# EAGLE design encoder_as5047p (EAGLE 9.3.1)
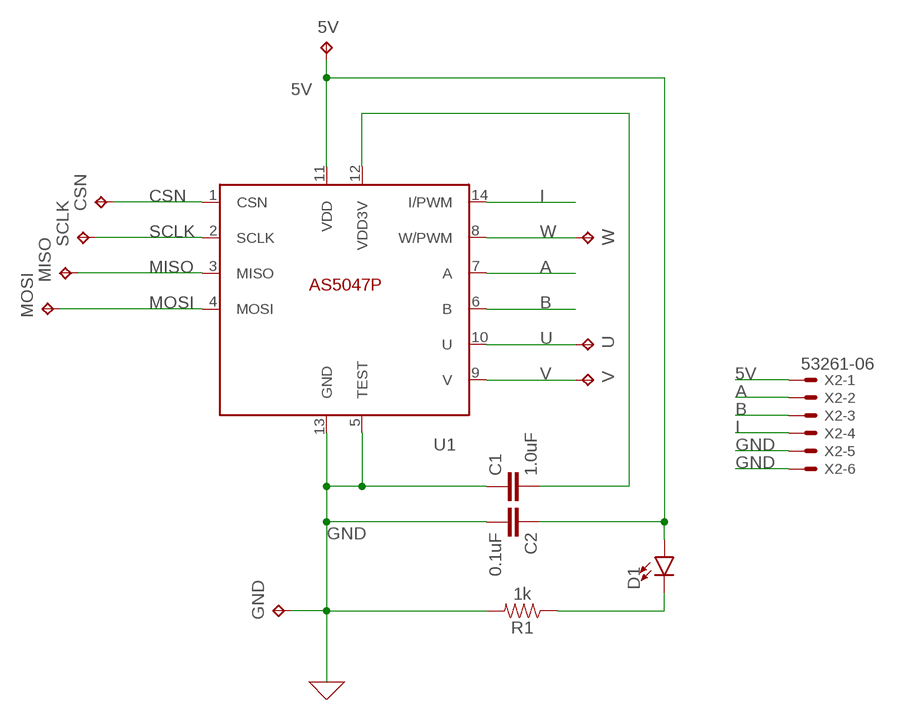
[diagram p0: schematic, sheet 1]

## Parts
5V  TPTP12R  [TP12R]
C1  1.0uF  1.0UF-0603-16V-10%  [0603]
C2  0.1uF  0.1UF-0603-25V-(+80/-20%)  [0603]
CSN  TPTP12R  [TP12R]
D1  LED0603  [LED-0603]
GND  TPTP12R  [TP12R]
MISO  TPTP12R  [TP12R]
MOSI  TPTP12R  [TP12R]
R1  1k  1KOHM-0603-1/10W-1%  [0603]
SCLK  TPTP12R  [TP12R]
U  TPTP12R  [TP12R]
U1  AS5047P  [TSSOP14]
V  TPTP12R  [TP12R]
W  TPTP12R  [TP12R]
X2  53261-06  [53261-06]

## Nets
5V: 5V.TP C2.1 D1.A U1.11(VDD) X2.1
A: U1.7(A) X2.2
B: U1.6(B) X2.3
CSN: CSN.TP U1.1(CSN)
GND: C1.1 C2.2 GND.TP R1.2 U1.5(TEST) U1.13(GND) X2.5 X2.6
I: U1.14(I/PWM) X2.4
MISO: MISO.TP U1.3(MISO)
MOSI: MOSI.TP U1.4(MOSI)
N$1: C1.2 U1.12(VDD3V)
N$2: D1.C R1.1
SCLK: SCLK.TP U1.2(SCLK)
U: U1.10(U) U.TP
V: U1.9(V) V.TP
W: U1.8(W/PWM) W.TP

## Library data of the parts
5V CSN GND MISO MOSI SCLK U V W = testpad:TP: Test pad
C1 = SparkFun-Capacitors:1.0UF: 1µF ceramic capacitors A capacitor is a passive two-terminal electrical component used to store electrical energy temporarily in an electric field.; PROD_ID: CAP-00868
C2 = SparkFun-Capacitors:0.1UF: 0.1µF ceramic capacitors A capacitor is a passive two-terminal electrical component used to store electrical energy temporarily in an electric field.; PROD_ID: CAP-00810
D1 = SparkFun-LED:LED: LED (Generic) Standard schematic elements and footprints for 5mm, 3mm, 1206, and 0603 sized LEDs. Generic LEDs with no color specified.
R1 = SparkFun-Resistors:1KOHM: 1kΩ resistor A resistor is a passive two-terminal electrical component that implements electrical resistance as a circuit element. Resistors act to reduce current flow, and, at the same time, act to lower voltage levels within circuits. - Wikipedia; PROD_ID: RES-07856
U1 = AMS-AS5047P-encoder:AS5047P
X2 = con-molex:53?-06: CONNECTOR wire to board 1.25 mm (.049 inch) pitch header; MF: MOLEX; OC_FARNELL: 1125375; OC_NEWARK: unknown

## Net classes
0 default: width 0.305 mm

## Board
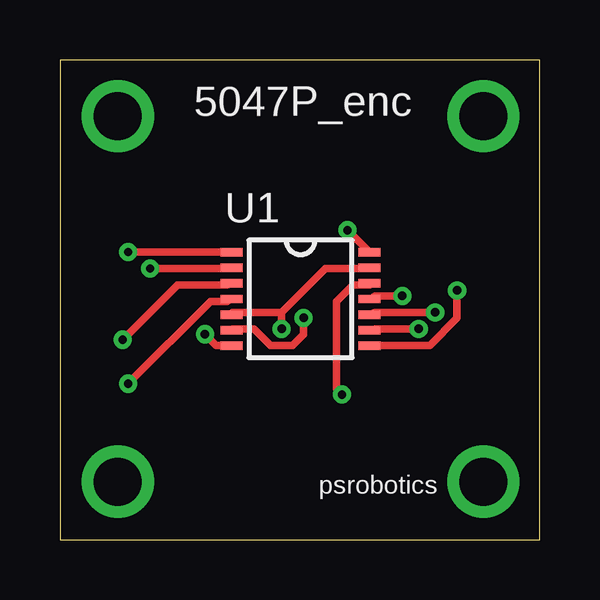
[diagram p1: board, top side]
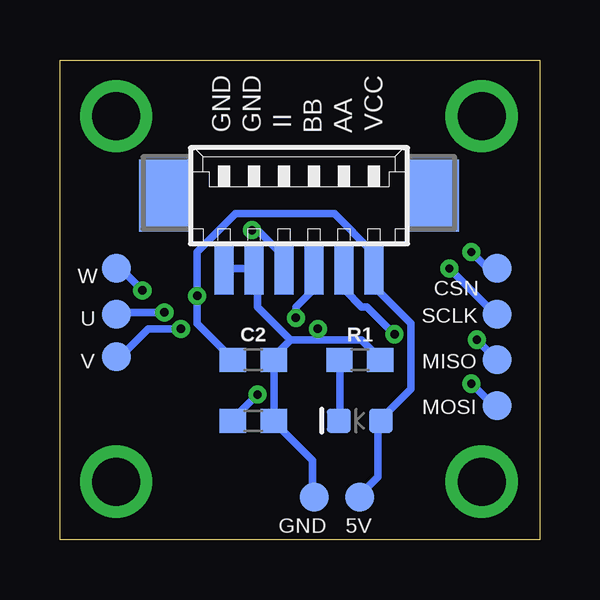
[diagram p2: board, bottom side, seen from below]

Size 20 x 20 mm. Coordinates in mm from the lower left corner, seen from the top.
Outline: 0,0 20,0 20,20 0,20 0,0
Copper layers (1*16): Top 0.035mm / dielectric 1.5mm / Bottom 0.035mm
Design rules "default": minimum track width 6mil, minimum drill 0.35mm, track to track 6mil, track to pad 6mil, pad to pad 6mil, via to via 6mil, smd to smd 6mil, copper to edge 40mil, drill to drill 6mil, minimum pad ring 10mil, minimum via ring 8mil, stop-mask expansion 4mil, vias tented up to drill 0mil, thermal gap 10mil

### Footprints (pad centres in the part's own frame; a part is rotated, then mirrored left to right if it is on the bottom)
TP12R = smd 1.2 x 1.2: TP 0,0
0603 = smd 1.1 x 1: 1 -0.85,0; 2 0.85,0
LED-0603 = smd 1 x 1: A -0.877,0; C 0.877,0
TSSOP14 = smd 0.9 x 0.35: 1 -2.875,1.95; 2 -2.875,1.3; 3 -2.875,0.65; 4 -2.875,0; 5 -2.875,-0.65; 6 -2.875,-1.3; 7 -2.875,-1.95; 8 2.875,-1.95; 9 2.875,-1.3; 10 2.875,-0.65; 11 2.875,0; 12 2.875,0.65; 13 2.875,1.3; 14 2.875,1.95
53261-06 = smd 0.8 x 2: 1 3.125,-2.5; 2 1.875,-2.5; 3 0.625,-2.5; 4 -0.625,-2.5; 5 -1.875,-2.5; 6 -3.125,-2.5 | smd 2.1 x 3: S1 5.625,0.625; S2 -5.625,0.625

### Placement (x,y rotation side)
5V  7.49,1.78 0 bottom
C1  11.94,4.95 180 bottom
C2  11.94,7.49 0 bottom
CSN  1.78,11.3 0 bottom
D1  7.49,4.95 180 bottom
GND  9.4,1.78 0 bottom
MISO  1.78,7.49 0 bottom
MOSI  1.78,5.59 0 bottom
R1  7.49,7.49 0 bottom
SCLK  1.78,9.4 0 bottom
U  17.65,9.4 0 bottom
U1  10.03,10.03 0 top
V  17.65,7.62 0 bottom
W  17.65,11.3 0 bottom
X2  10.03,13.72 0 bottom

### Tracks (layer width: path | path; a pad name or v marks a point on that pad's centre or on a via)
5V  (via drill 0.35)
  Top 0.305: v14.28,10.16 13.13,10.16 U1.11
  Bottom 0.305: C2.1 12.9,7.64 14.28,9.02 v14.28,10.16 14.28,11.99 12.68,13.59 8.56,13.59 6.96,11.99 6.96,11.3 X2.1 6.73,11.07 6.73,10.39 5.36,9.02 5.36,6.27 6.5,5.13 D1.A 6.73,4.9 6.73,2.62 7.42,1.93 5V.TP
A  (via drill 0.35)
  Top 0.305: v6.04,8.56 6.5,8.1 6.96,8.1 U1.7
  Bottom 0.305: v6.04,8.56 7.19,9.7 7.42,9.7 8.1,10.39 8.1,11.07 X2.2
B  (via drill 0.35)
  Top 0.305: v10.16,9.25 10.16,8.56 9.7,8.1 8.79,8.1 8.1,8.79 7.19,8.79 U1.6
  Bottom 0.305: v10.16,9.25 10.16,9.7 9.47,10.39 9.47,11.07 X2.3
CSN  (via drill 0.35)
  Top 0.305: v2.85,11.99 6.96,11.99 U1.1
  Bottom 0.305: v2.85,11.99 2.16,11.3 CSN.TP
GND  (via drill 0.35)
  Top 0.305: 9.25,9.47 7.19,9.47 U1.5 | 9.25,9.47 11.07,11.3 12.9,11.3 U1.13 | v9.25,8.79 9.25,9.47
  Bottom 0.305: X2.6 13.13,11.3 11.99,11.3 X2.5 11.76,11.07 11.76,9.7 10.39,8.33 | 10.39,8.33 9.25,8.33 | 9.25,8.33 7.42,8.33 6.73,7.64 R1.2 | 10.39,8.33 11.07,7.64 C2.2 11.07,7.42 11.07,5.13 C1.1 11.07,4.9 9.47,3.3 9.47,1.93 GND.TP | 9.25,8.33 v9.25,8.79
I  (via drill 0.35)
  Top 0.305: v11.99,12.9 U1.14
  Bottom 0.305: v11.99,12.9 11.76,12.9 10.85,11.99 10.85,11.3 X2.4
MISO  (via drill 0.35)
  Top 0.305: v2.62,8.33 4.9,10.62 6.96,10.62 U1.3
  Bottom 0.305: MISO.TP v2.62,8.33
MOSI  (via drill 0.35)
  Top 0.305: v2.85,6.5 6.27,9.93 6.96,9.93 U1.4
  Bottom 0.305: v2.85,6.5 1.93,5.59 MOSI.TP
N$1  (via drill 0.35)
  Top 0.305: v11.76,6.04 11.53,6.27 11.53,9.93 12.22,10.62 12.9,10.62 U1.12
  Bottom 0.305: v11.76,6.04 12.68,5.13 C1.2
N$2
  Bottom 0.305: D1.C 8.33,5.13 8.33,7.42 R1.1
N$3  (via drill 2.01)
  other vias: 2.41,17.65
N$4  (via drill 2.01)
  other vias: 2.41,2.41
N$5  (via drill 2.01)
  other vias: 17.65,17.65
N$6  (via drill 2.01)
  other vias: 17.65,2.41
SCLK  (via drill 0.35)
  Top 0.305: v3.76,11.3 6.96,11.3 U1.2
  Bottom 0.305: v3.76,11.3 1.93,9.47 SCLK.TP
U  (via drill 0.35)
  Top 0.305: v15.65,9.47 13.13,9.47 U1.10
  Bottom 0.305: v15.65,9.47 17.48,9.47 U.TP
V  (via drill 0.35)
  Top 0.305: v14.96,8.79 13.13,8.79 U1.9
  Bottom 0.305: v14.96,8.79 16.33,8.79 17.48,7.64 V.TP
W  (via drill 0.35)
  Top 0.305: v16.56,10.39 16.56,9.25 15.42,8.1 13.13,8.1 U1.8
  Bottom 0.305: v16.56,10.39 17.48,11.3 W.TP

### Text on the board
tPlace: 5047P_enc | psrobotics
bPlace: VCC | GND | GND | AA | BB | II